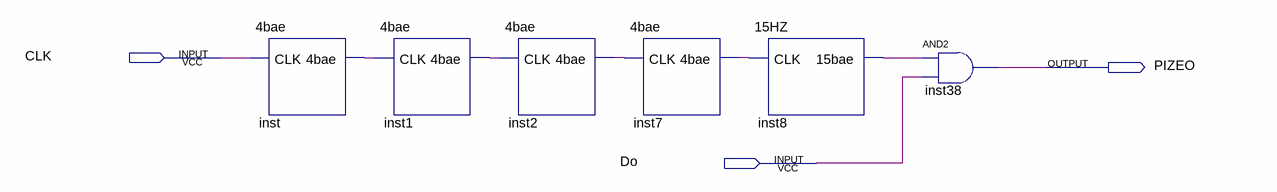
[diagram p0: schematic sheet]
// Quartus schematic Do.bdf as structural Verilog: 6 symbols, 3 pins
module Do (
  input  CLK,
  input  Do,
  output PIZEO
);

  wire inst1_4bae, inst2_4bae, inst7_4bae, inst8_15bae, inst_4bae;

  \4bae  inst (.CLK(CLK), .\4bae (inst_4bae));
  \4bae  inst1 (.CLK(inst_4bae), .\4bae (inst1_4bae));
  \4bae  inst2 (.CLK(inst1_4bae), .\4bae (inst2_4bae));
  \4bae  inst7 (.CLK(inst2_4bae), .\4bae (inst7_4bae));
  \15HZ  inst8 (.CLK(inst7_4bae), .\15bae (inst8_15bae));
  and inst38 (PIZEO, inst8_15bae, Do);
endmodule
